# Altium schematic sheet memory.SchDoc: Storage system
size A4; Organization: Tweetonig; Address1: Delftsestraat 11; DocumentNumber: 4; Revision: 1.0; SheetNumber: 4; SheetTotal: 9
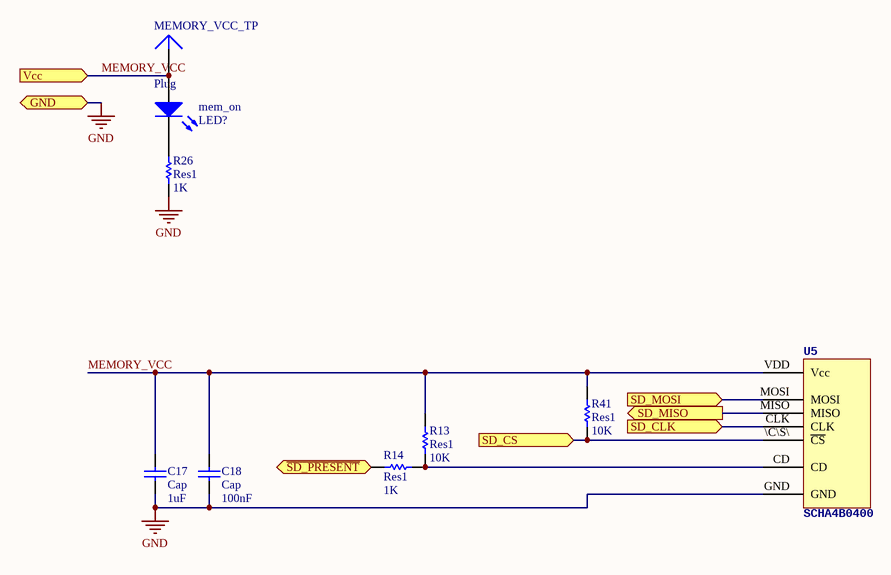
[diagram p0: memory.SchDoc]

## Parts
C17  Cap  value 1uF  [C0603]
C18  Cap  value 100nF  [C0603]
mem_on  LED?  [C0603]
MEMORY_VCC_TP  Plug  [PIN1]
R13  Res1  value 10K  [R0603]
R14  Res1  value 1K  [R0603]
R26  Res1  value 1K  [R0603]
R41  Res1  value 10K  [R0603]
U5  SCHA4B0400  [SCHA4B0400]

## Ports
GND, SD_CLK (in), SD_CS (in), SD_MISO (out), SD_MOSI (in), Vcc (in), ~{SD_PRESENT} (out)

## Nets
GND: C17.1 C18.1 R26.1 U5.GND ; port GND
~{SD_PRESENT}: R14.2 ; port ~{SD_PRESENT}
MEMORY_VCC: C17.2 C18.2 mem_on.1(A) MEMORY_VCC_TP.1 R13.1 R41.2 U5.VDD(Vcc) ; port Vcc
SD_CLK: U5.CLK ; port SD_CLK
SD_CS: R41.1 U5.\C\S\(~{CS}) ; port SD_CS
SD_MISO: U5.MISO ; port SD_MISO
SD_MOSI: U5.MOSI ; port SD_MOSI
Netmem_on_2: mem_on.2(K) R26.2
NetR13_2: R13.2 R14.1 U5.CD

## Notes on the sheet
- Title
- Size:
- Date:
- A4
- Number:
- Time:
- Revision:
- Sheet
- of
- The Things Products
- Project:
- File:

## Library data of the parts
C17 C18 = Cap: Capacitor; Published: 8-Jun-2000; LatestRevisionDate: 17-Jul-2002; LatestRevisionNote: Re-released for DXP Platform.; PackageReference: RAD-0.3; Publisher: Altium Limited; PackageDescription: Radial Cap, Thru-Hole; 2 Leads; 0.3 in Pin Spacing
mem_on = LED0: Typical INFRARED GaAs LED; Published: 8-Jun-2000; LatestRevisionDate: 08-Jul-2005; LatestRevisionNote: Mech Layer 1 removed.; PackageReference: LED-0; Publisher: Altium Limited; PackageDescription: LED; 2 Leads
R13 R14 R26 R41 = Res1: Resistor; Published: 8-Jun-2000; LatestRevisionDate: 17-Jul-2002; LatestRevisionNote: Re-released for DXP Platform.; PackageReference: AXIAL-0.3; Publisher: Altium Limited; PackageDescription: Axial Device, Thru-Hole; 2 Leads; 0.3 in Pin Spacing
MEMORY_VCC_TP = Plug: LatestRevisionDate: 17-Jul-2002; LatestRevisionNote: Re-released for DXP Platform.; Publisher: Altium Limited